# Altium schematic sheet 01_USB Isolator.SchDoc: =GlobalProjectName
size 594 x 420 mm; CheckedBy: A_D; Author: A_D; SheetNumber: 1; SheetTotal: 2; PageSetup: Record=PageOptions|CenterHorizontal=True|CenterVertical=True|PrintScale=0.70|XCorrection=1.00|YCorrection=1.00|PrintKind=2|BorderSize=5000000|LeftOffset=9000|BottomOffset=10100|Orientation=2|PaperLength=11176|PaperWidth=8636|Scale=100|PaperSource=259|PrintQuality=-3|MediaType=1|DitherType=10|PrintScaleMode=1|PaperKind=A3|PaperIndex=8
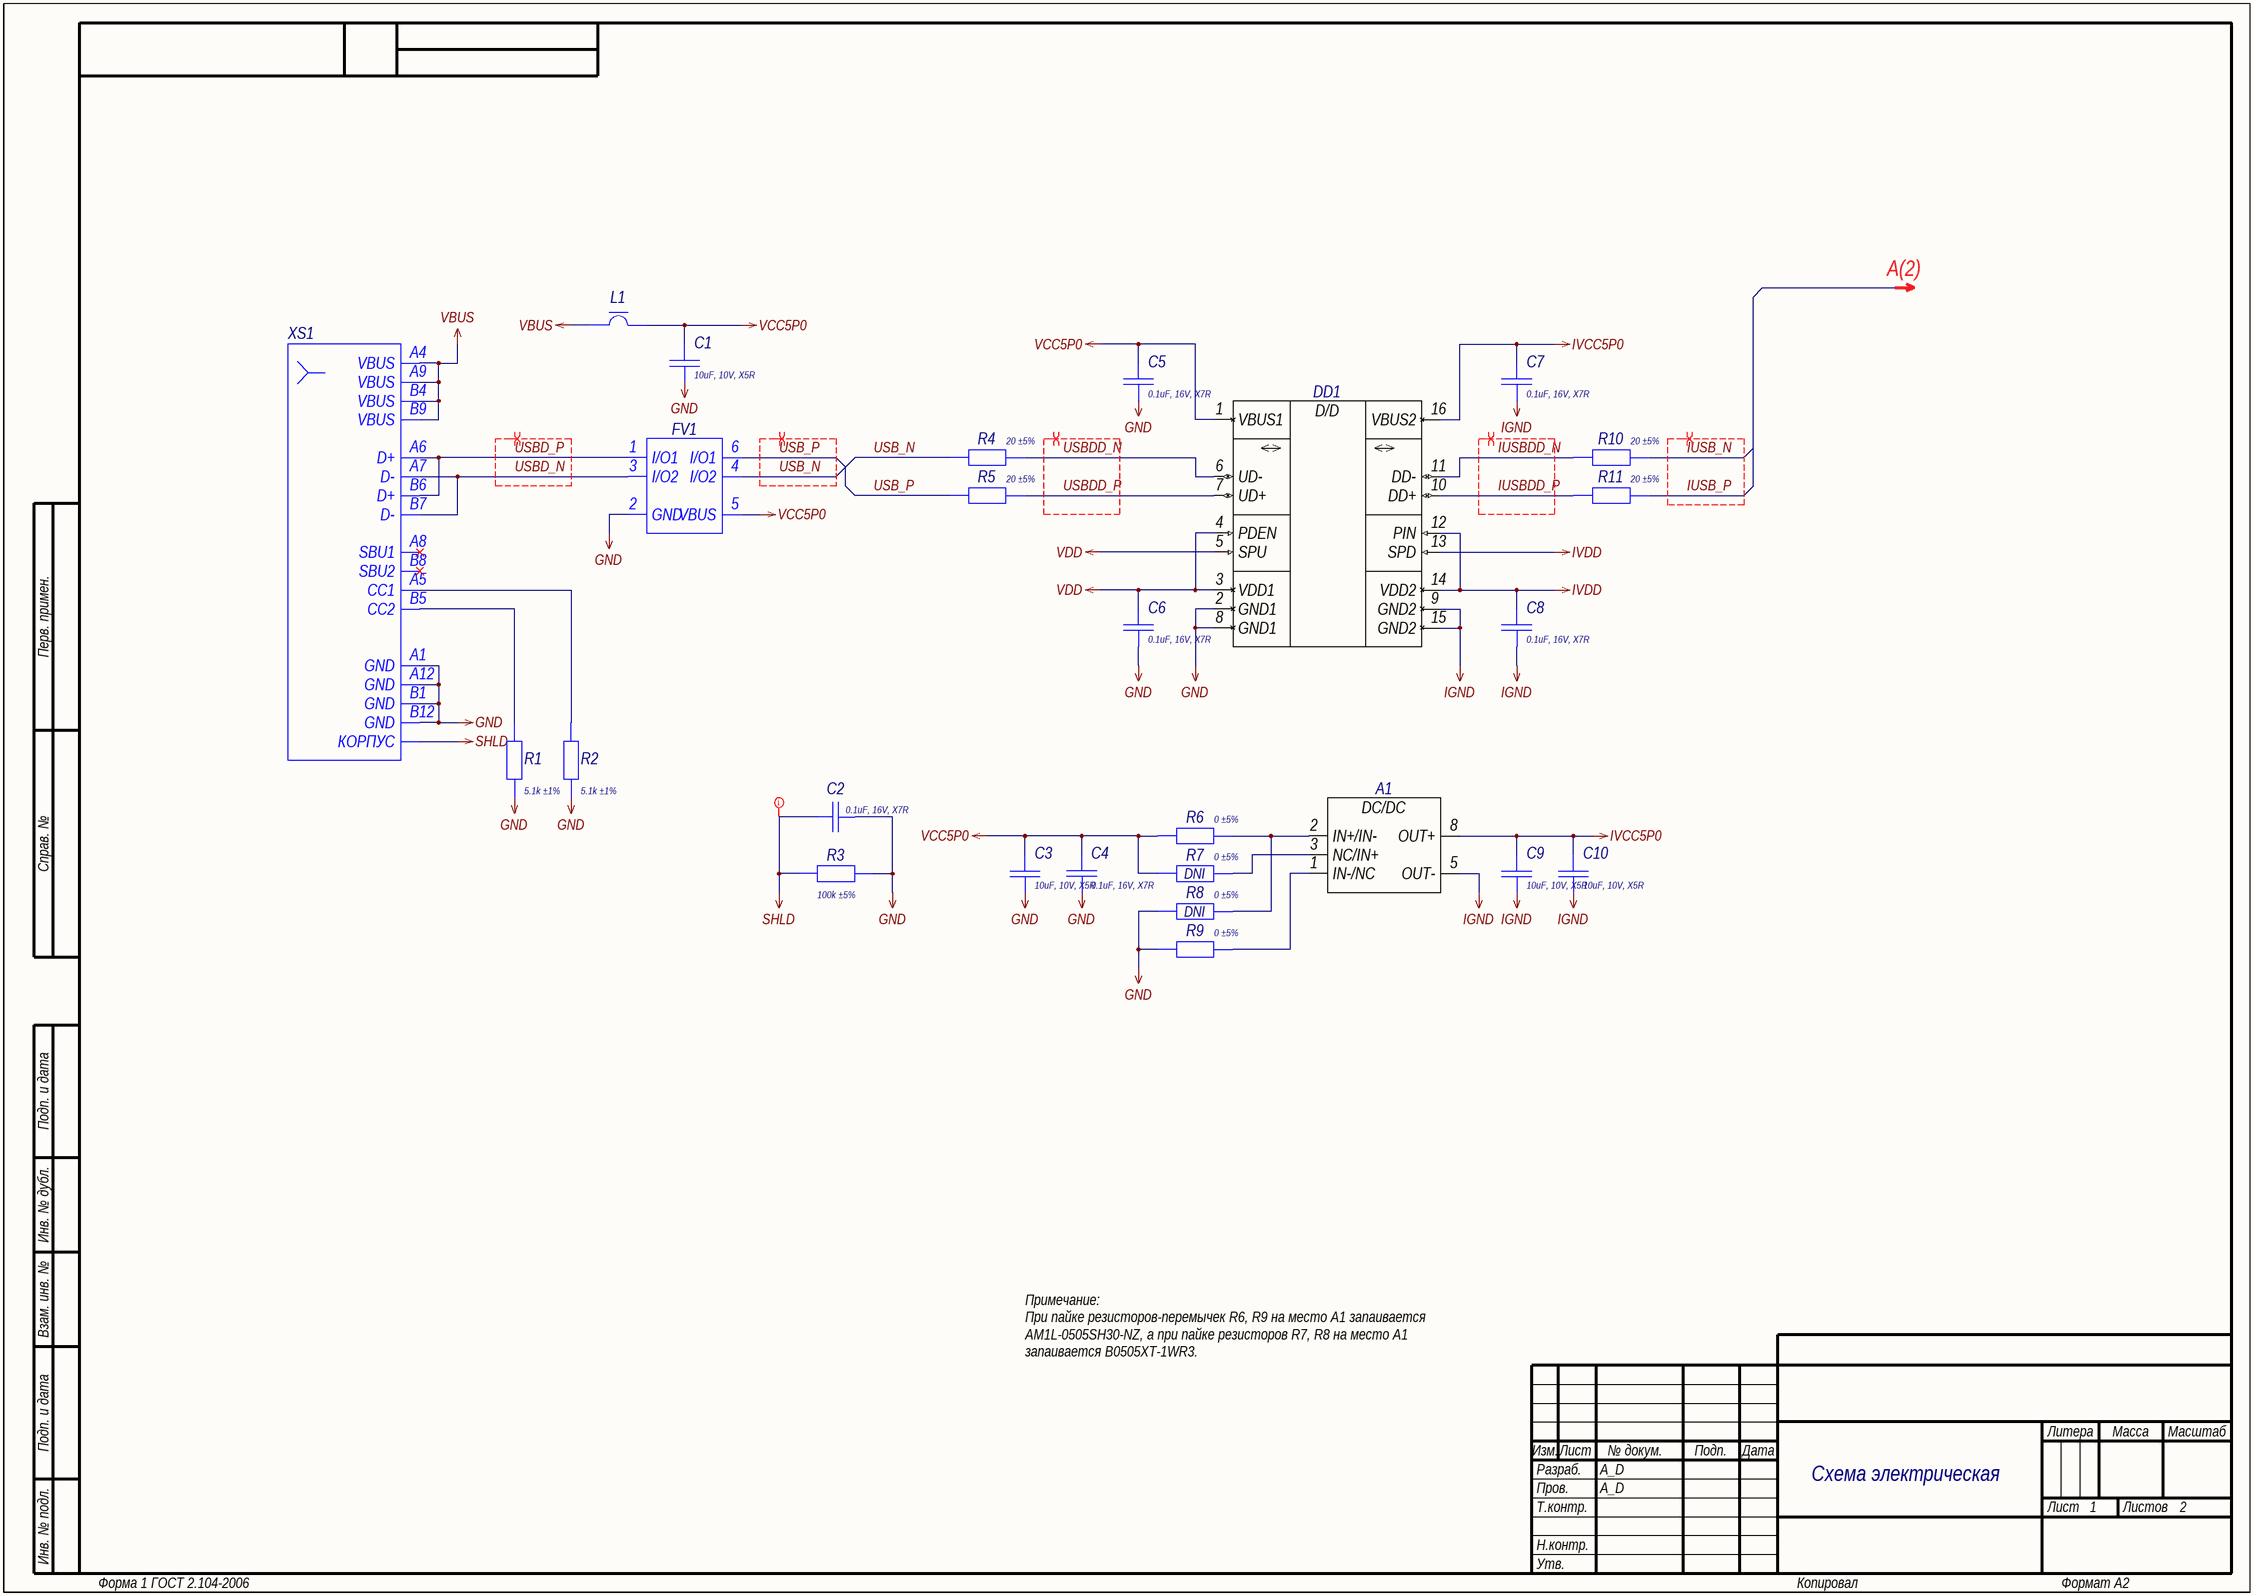
[diagram p0: 01_USB Isolator.SchDoc]

## Parts
A1  AM1L-xxxxSH30-Series  [AM1L-xxxxSH30-Series]  (value not drawn)
C1  Schematic Value: 10uF, 10V, X5R  [C0603_L]  (hidden comment: Capacitor)
C2  Schematic Value: 0.1uF, 16V, X7R  [C0402_L]  (hidden comment: Capacitor)
C3  Schematic Value: 10uF, 10V, X5R  [C0603_L]  (hidden comment: Capacitor)
C4  Schematic Value: 0.1uF, 16V, X7R  [C0402_L]  (hidden comment: Capacitor)
C5  Schematic Value: 0.1uF, 16V, X7R  [C0402_L]  (hidden comment: Capacitor)
C6  Schematic Value: 0.1uF, 16V, X7R  [C0402_L]  (hidden comment: Capacitor)
C7  Schematic Value: 0.1uF, 16V, X7R  [C0402_L]  (hidden comment: Capacitor)
C8  Schematic Value: 0.1uF, 16V, X7R  [C0402_L]  (hidden comment: Capacitor)
C9  Schematic Value: 10uF, 10V, X5R  [C0603_L]  (hidden comment: Capacitor)
C10  Schematic Value: 10uF, 10V, X5R  [C0603_L]  (hidden comment: Capacitor)
DD1  ADuMx160-Series  [SOIC-16_127P1030X750X265_N]  (value not drawn)
FV1  USBLC6-2x6  [SOT-666_050P160X120X060_N]  (value not drawn)
L1  FerriteBead  [L0402_L]  (value not drawn)
R1  Schematic Value: 5.1k ±1%  [R0402_L]  (hidden comment: Resistor)
R2  Schematic Value: 5.1k ±1%  [R0402_L]  (hidden comment: Resistor)
R3  Schematic Value: 100k ±5%  [R0402_L]  (hidden comment: Resistor)
R4  Schematic Value: 20 ±5%  [R0402_L]  (hidden comment: Resistor)
R5  Schematic Value: 20 ±5%  [R0402_L]  (hidden comment: Resistor)
R6  Schematic Value: 0 ±5%  [R0402_L]  (hidden comment: Resistor)
R7  Schematic Value: 0 ±5%  [R0402_L]  (hidden comment: Resistor)  (no BOM)
R8  Schematic Value: 0 ±5%  [R0402_L]  (hidden comment: Resistor)  (no BOM)
R9  Schematic Value: 0 ±5%  [R0402_L]  (hidden comment: Resistor)
R10  Schematic Value: 20 ±5%  [R0402_L]  (hidden comment: Resistor)
R11  Schematic Value: 20 ±5%  [R0402_L]  (hidden comment: Resistor)
XS1  Text  [U262-161N-4BVC11]  (value not drawn)

## Nets
GND: C1.1 C2.1 C3.1 C4.2 C5.2 C6.2 DD1.2(GND1) DD1.8(GND1) FV1.2(GND) R1.1 R2.1 R3.2 R8.1 R9.1 XS1.A1(GND) XS1.A12(GND) XS1.B1(GND) XS1.B12(GND)
IGND: A1.5(OUT-) C7.2 C8.2 C9.1 C10.1 DD1.9(GND2) DD1.15(GND2)
IVCC5P0: A1.8(OUT+) C7.1 C9.2 C10.2 DD1.16(VBUS2)
IVDD: C8.1 DD1.12(PIN) DD1.13(SPD) DD1.14(VDD2)
SHLD: C2.2 R3.1 XS1.SH(КОРПУС)
VBUS: L1.1 XS1.A4(VBUS) XS1.A9(VBUS) XS1.B4(VBUS) XS1.B9(VBUS)
VCC5P0: C1.2 C3.2 C4.1 C5.1 DD1.1(VBUS1) FV1.5(VBUS) L1.2 R6.1 R7.1
VDD: C6.1 DD1.3(VDD1) DD1.4(PDEN) DD1.5(SPU)
IUSB_N: R10.2
IUSB_P: R11.2
IUSBDD_N: DD1.11(DD-) R10.1
IUSBDD_P: DD1.10(DD+) R11.1
USB_N: FV1.4(I/O2) R4.1
USB_P: FV1.6(I/O1) R5.1
USBD_N: FV1.3(I/O2) XS1.A7(D-) XS1.B7(D-)
USBD_P: FV1.1(I/O1) XS1.A6(D+) XS1.B6(D+)
USBDD_N: DD1.6(UD-) R4.2
USBDD_P: DD1.7(UD+) R5.2
NetA1_1: A1.1(IN-/NC) R9.2
NetA1_2: A1.2(IN+/IN-) R6.2 R8.2
NetA1_3: A1.3(NC/IN+) R7.2
NetR1_2: R1.2 XS1.B5(CC2)
NetR2_2: R2.2 XS1.A5(CC1)

Not connected (* = marked no-connect by the designer): XS1 A8(SBU1)* B8(SBU2)*

## Layout directives
differential pair; differential pair class USBD: USBD_N, USBD_P
differential pair; differential pair class USB: IUSB_N, IUSB_P, USB_N, USB_P
differential pair: IUSBDD_N, IUSBDD_P, USBDD_N, USBDD_P
rule Clearance Constraint [Clearance = 0.3mm]: SHLD

## Notes on the sheet
- А(2)
- (near R7) DNI
- (near R8) DNI
- Примечание:
  При пайке резисторов-перемычек R6, R9 на место A1 запаивается AM1L-0505SH30-NZ, а при пайке резисторов R7, R8 на место А1 запаивается B0505XT-1WR3.
- Схема электрическая
  принципиальная
- Перв. примен.
- Справ. №
- Подп. и дата
- Инв. № дубл.
- Взам. инв. №
- Разраб.
- Изм.
- Лист
- № докум.
- Подп.
- Дата
- Литера
- Масса
- Масштаб
- Пров.
- Т.контр.
- Листов
- Инв. № подл.
- Н.контр.
- Утв.
- Форма 1 ГОСТ 2.104-2006
- Копировал
- Формат А2
- (in symbol ADUM3160BRWZ) D/D
- (in symbol AM1L-0505SH30-NZ) DC/DC

## Library data of the parts
A1 = AM1L-0505SH30-NZ: Manufacturer: Aimtec; ID: 2; Supply Operation: +4.5…5.5V; Output Current Min: +20mA; Output Current Max: +200mA; Output Voltage: +5V; Efficiency: 70%; I-O Isolation: 3kV; Application Category: 1; Working Temperature Min: -40°С; Working Temperature Max: +85°С; Published: 29.07.2015; Publisher: Andrew Danich; Type: Модуль; Part Number: AM1L-0505SH30-NZ; Value: AM1L-0505SH30-NZ; Functional Analog: -
C1 C3 C9 C10 = GRM188R61A106KE69D: Manufacturer: Murata; Type: Конденсатор; ID: 173; Value: 10uF; Voltage: 10V; Tolerance: ±10%; Dielectric Type: X5R; Application Category: 1; Working Temperature Min: -55°С; Working Temperature Max: +85°С; Published: 18.05.2010; Publisher: Andrew Danich; Part Number: GRM188R61A106KE69D; Footprint: 0603; ClassName: DirectConnect
C2 C4-C8 = GCM155R71C104KA55D: Manufacturer: Murata; Type: Конденсатор; ID: 163; Value: 0.1uF; Voltage: 16V; Tolerance: ±10%; Dielectric Type: X7R; Application Category: 1; Working Temperature Min: -55°С; Working Temperature Max: +125°С; Functional Analog: GRM155R71C104KA88D; Published: 18.05.2010; Publisher: Andrew Danich; Part Number: GCM155R71C104KA55D; Footprint: 0402
  C2: ClassName: DirectConnect
DD1 = ADUM3160BRWZ: Manufacturer: Analog Devices; ID: 1; Supply Operation: +4.5…5.5V; Supply Current: 8mA; Data Rate: 12Mbts; Forward Channels: 2; Peak-to-peak Jitter: 3ns; Interface: USB 2.0; Functional Analog: ADUM4160BRWZ; Published: 29.07.2015; Publisher: Andrew Danich; Type: Микросхема; Part Number: ADUM3160BRWZ; Value: ADUM3160BRWZ; Opposite Channels: 2; Application Category: 1
FV1 = USBLC6-2P6: Manufacturer: STMicroelectronics; ID: 30; Breakdown Voltage: 6V; Reverse Stand Off Voltage: 17V; Forward Voltage: 0.95V; Peak Forward Current: 5A; Junction Capacitance: 2.5pF; Directional: Bidirectional; Application Category: 1; Working Temperature Min: -40°С; Working Temperature Max: +125°С; Published: 21.02.2017; Publisher: Andrew Danich; Type: Супрессор; Part Number: USBLC6-2P6; Value: USBLC6-2P6; Functional Analog: -; ClassName: DirectConnect
L1 = BLM15PD121SN1D: Manufacturer: Murata; Type: Дроссель; ID: 11; Rated Current: 1.3A; Impedance at 100Mhz: 120ohm; Tolerance: ±25%; DC Resistance: 0.09ohm; Inductor Type: EMIFIL; Application Category: 1; Working Temperature Min: -55°С; Working Temperature Max: +125°С; Published: 14.11.2014; Publisher: Andrew Danich; Part Number: BLM15PD121SN1D; Value: BLM15PD121SN1D; Footprint: 0402; ClassName: DirectConnect
R1 R2 = RC0402FR-075K1L: Manufacturer: Yageo; ID: 496; Value: 5.1k; Limit Voltage: 50V; Tolerance: ±1%; Temperature Coefficient: 100ppm; Total Power Dissipation: 0.1W; Series Type: Thick-Film; Application Category: 1; Working Temperature Min: -55°С; Working Temperature Max: +155°С; Published: 24.03.2010; Publisher: Andrew Danich; Type: Резистор; Part Number: RC0402FR-075K1L; Footprint: 0402
R3 = RC0402JR-07100KL: Manufacturer: Yageo; ID: 351; Value: 100k; Limit Voltage: 50V; Tolerance: ±5%; Temperature Coefficient: 100ppm; Total Power Dissipation: 0.1W; Series Type: Thick-Film; Application Category: 1; Working Temperature Min: -55°С; Working Temperature Max: +155°С; Published: 24.03.2010; Publisher: Andrew Danich; Type: Резистор; Part Number: RC0402JR-07100KL; Footprint: 0402; ClassName: DirectConnect
R4 R5 R10 R11 = RC0402JR-0720RL: Manufacturer: Yageo; ID: 369; Value: 20; Limit Voltage: 50V; Tolerance: ±5%; Temperature Coefficient: 100ppm; Total Power Dissipation: 0.1W; Series Type: Thick-Film; Application Category: 1; Working Temperature Min: -55°С; Working Temperature Max: +155°С; Published: 24.03.2010; Publisher: Andrew Danich; Type: Резистор; Part Number: RC0402JR-0720RL; Footprint: 0402
R6-R9 = RC0402JR-070RL: Manufacturer: Yageo; ID: 362; Value: 0; Limit Voltage: 50V; Tolerance: ±5%; Temperature Coefficient: 100ppm; Total Power Dissipation: 0.1W; Series Type: Thick-Film; Application Category: 1; Working Temperature Min: -55°С; Working Temperature Max: +155°С; Published: 24.03.2010; Publisher: Andrew Danich; Type: Резистор; Part Number: RC0402JR-070RL; Footprint: 0402
XS1 = U262-161N-4BVC11: Manufacturer: XKB Enterprise; ID: 41; Limit Voltage: 30V; Limit Current: 3A; Connector Type: Female; Interface: USB 3.1 Type C; Max Data Rate: 480 mbps; Application Category: 1; Working Temperature Min: -40°С; Working Temperature Max: +85°С; Functional Analog: C167321; Published: 17.09.2018; Publisher: Andrew Danich; Type: Розетка; Part Number: U262-161N-4BVC11; Value: U262-161N-4BVC11; Pins: 16; Mount Type: Surface; ClassName: DirectConnect